# Altium schematic sheet 底板.SchDoc
size A3
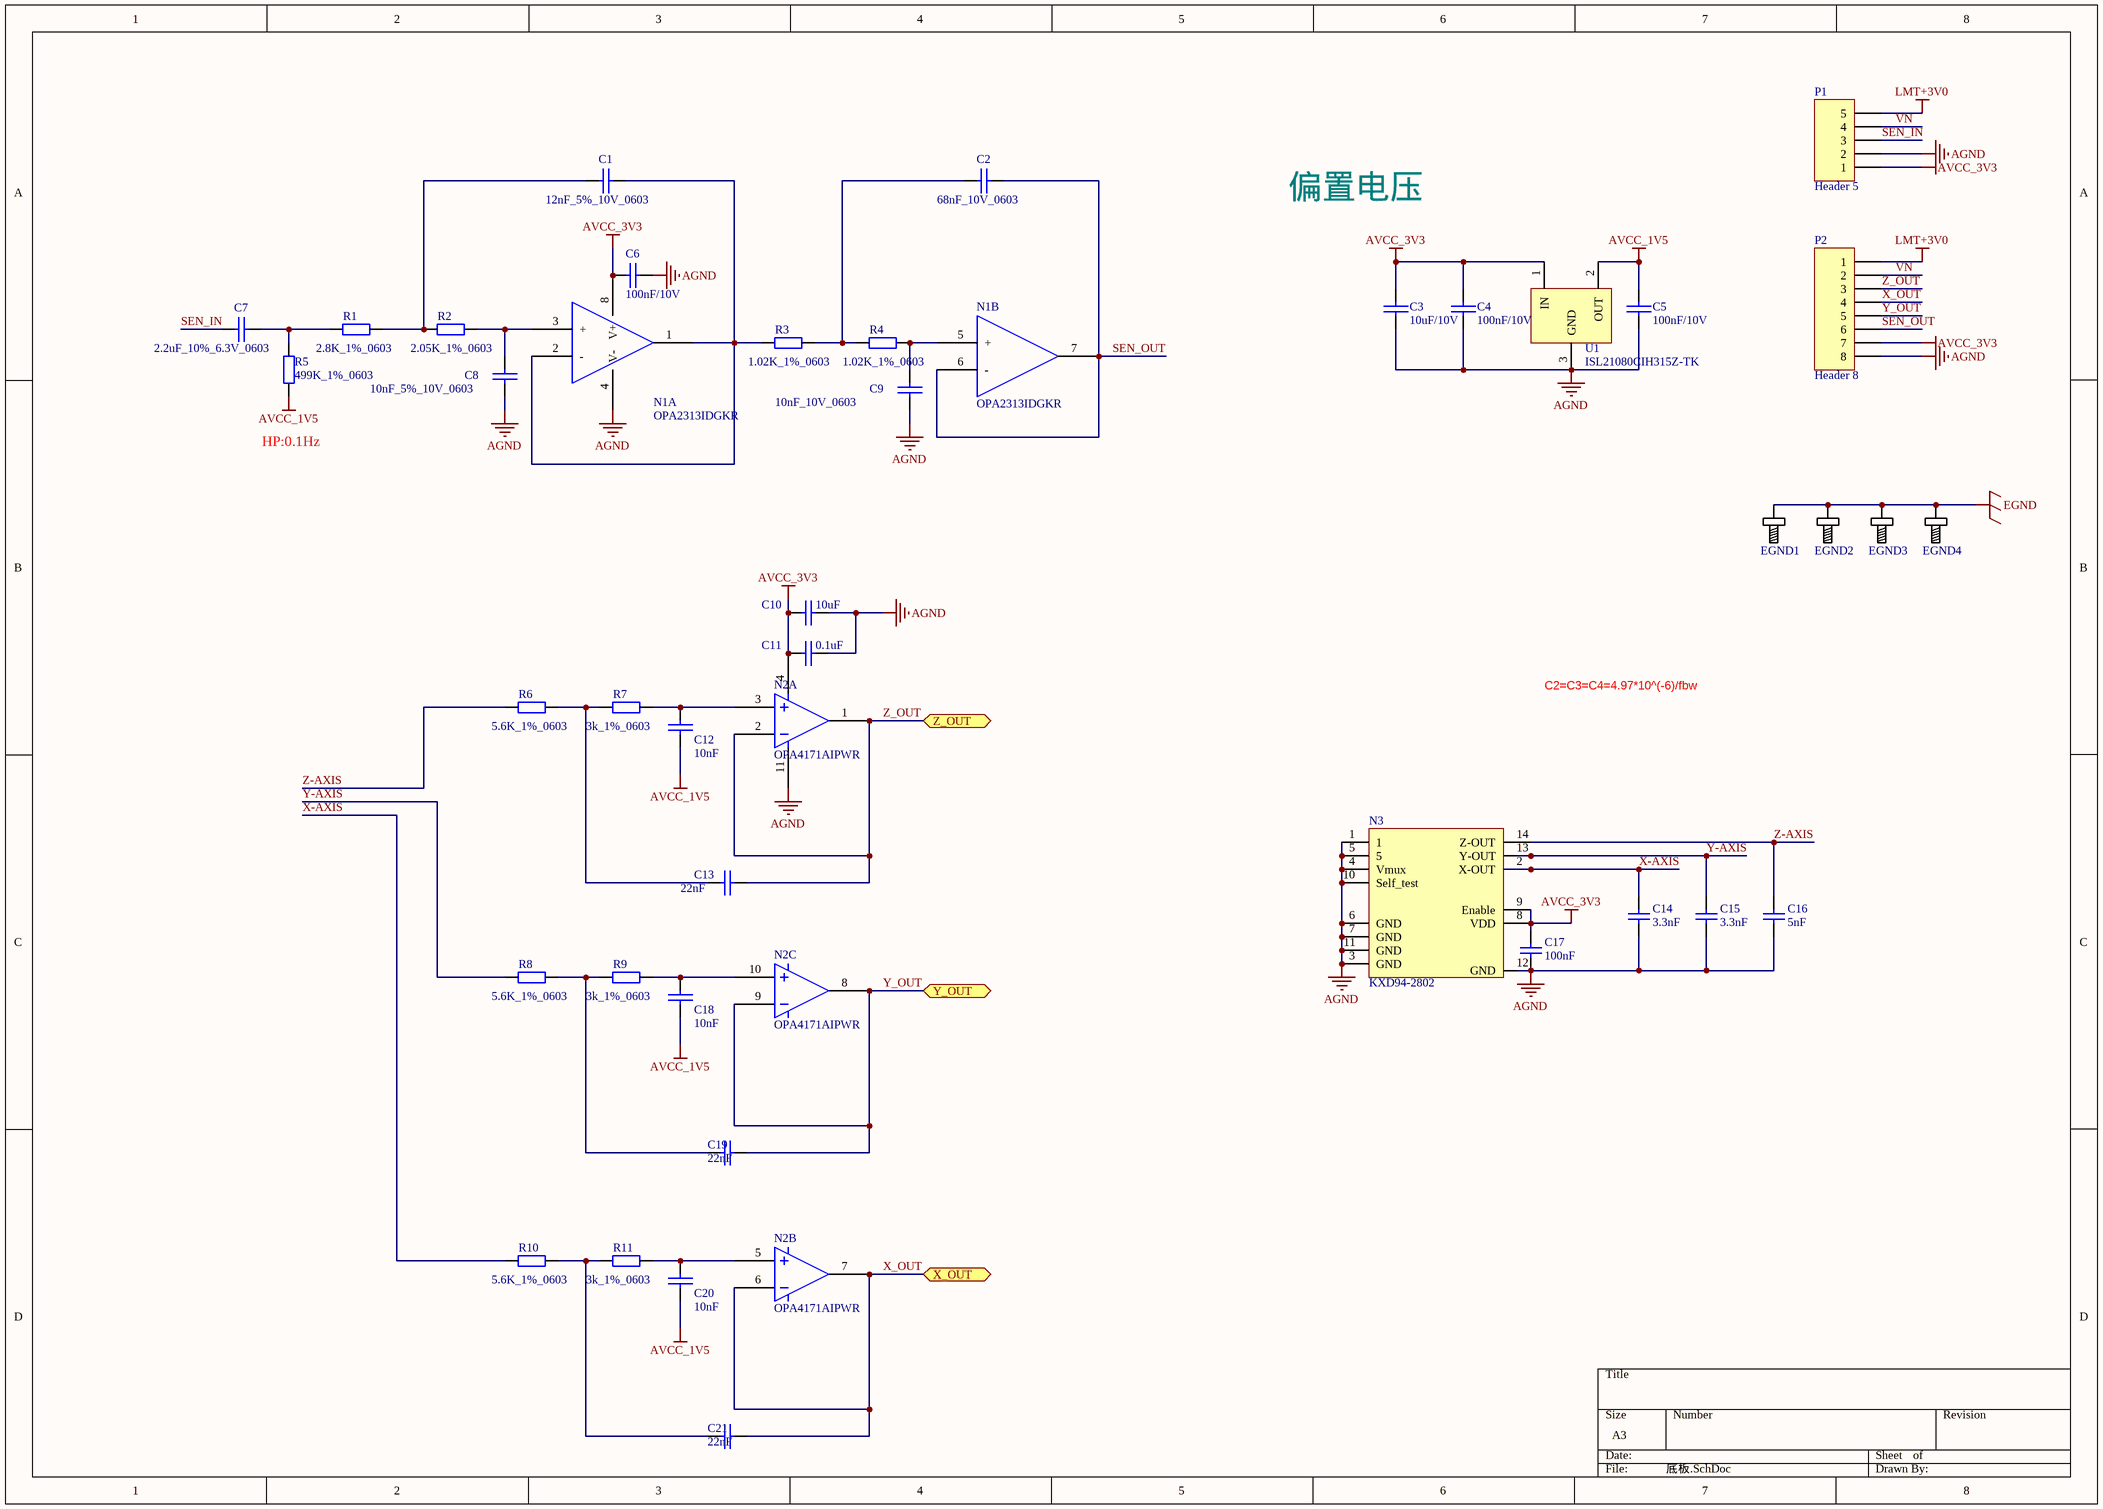
[diagram p0: 底板.SchDoc]

## Parts
C1  12nF_5%_10V_0603  [0603C]
C2  68nF_10V_0603  [0603C]
C3  10uF/10V  [0603c]
C4  100nF/10V  [0603C]
C5  100nF/10V  [0603C]
C6  100nF/10V  [0603C]
C7  2.2uF_10%_6.3V_0603  [0603c]
C8  10nF_5%_10V_0603  [0603C]
C9  10nF_10V_0603  [0603C]
C10  10uF  [0603C]
C11  0.1uF  [0603C]
C12  10nF  [0603C]
C13  22nF  [0603C]
C14  3.3nF  [0603C]
C15  3.3nF  [0603C]
C16  5nF  [0603C]
C17  100nF  [0603C]
C18  10nF  [0603C]
C19  22nF  [0603C]
C20  10nF  [0603C]
C21  22nF  [0603C]
EGND1  EGND  [M2.5x4_L]  (value not drawn)  (no BOM)
EGND2  EGND  [M2.5x4_L]  (value not drawn)  (no BOM)
EGND3  EGND  [M2.5x4_L]  (value not drawn)  (no BOM)
EGND4  EGND  [M2.5x4_L]  (value not drawn)  (no BOM)
N1  OPA2313IDGKR  [MSOP8_M]  (parts A,B of 2)
N2  OPA4171AIPWR  [TSSOP14_L]  (parts A,B,C of 4)
N3  KXD94-2802  [LFDFN-14]
P1  Header 5  [5p]
P2  Header 8  [FPC1.0-2H-WS-8P]
R1  2.8K_1%_0603  [0603R]
R2  2.05K_1%_0603  [0603R]
R3  1.02K_1%_0603  [0603R]
R4  1.02K_1%_0603  [0603R]
R5  499K_1%_0603  [0603R]
R6  5.6K_1%_0603  [0603R]
R7  3k_1%_0603  [0603R]
R8  5.6K_1%_0603  [0603R]
R9  3k_1%_0603  [0603R]
R10  5.6K_1%_0603  [0603R]
R11  3k_1%_0603  [0603R]
U1  ISL21080CIH315Z-TK  [SOT23-3N]

## Ports
X_OUT, Y_OUT, Z_OUT

## Nets
AGND: C3.2 C4.2 C5.2 C6.2 C8.1 C9.1 C10.1 C11.1 C14.2 C15.2 C16.2 C17.2 N1.4(V-) N2.11 N3.1 N3.3(GND) N3.4(Vmux) N3.5 N3.6(GND) N3.7(GND) N3.10(Self_test) N3.11(GND) N3.12(GND) P1.2 P2.8 U1.3(GND)
AVCC_1V5: C5.1 C12.2 C18.2 C20.2 R5.1 U1.2(OUT)
AVCC_3V3: C3.1 C4.1 C6.1 C10.2 C11.2 C17.1 N1.8(V+) N2.4 N3.8(VDD) N3.9(Enable) P1.1 P2.7 U1.1(IN)
EGND: EGND1.0 EGND2.0 EGND3.0 EGND4.0
LMT+3V0: P1.5 P2.1
SEN_IN: C7.2 P1.3
SEN_OUT: C2.1 N1.6(-) N1.7 P2.6
VN: P1.4 P2.2
X-AXIS: C14.1 N3.2(X-OUT) R10.1
X_OUT: C21.2 N2.6 N2.7 P2.4 ; port X_OUT
Y-AXIS: C15.1 N3.13(Y-OUT) R8.1
Y_OUT: C19.2 N2.8 N2.9 P2.5 ; port Y_OUT
Z-AXIS: C16.1 N3.14(Z-OUT) R6.1
Z_OUT: C13.2 N2.1 N2.2 P2.3 ; port Z_OUT
NetC1_1: C1.1 N1.1 N1.2(-) R3.1
NetC1_2: C1.2 R1.2 R2.1
NetC2_2: C2.2 R3.2 R4.1
NetC7_1: C7.1 R1.1 R5.2
NetC8_2: C8.2 N1.3(+) R2.2
NetC9_2: C9.2 N1.5(+) R4.2
NetC12_1: C12.1 N2.3 R7.2
NetC13_1: C13.1 R6.2 R7.1
NetC18_1: C18.1 N2.10 R9.2
NetC19_1: C19.1 R8.2 R9.1
NetC20_1: C20.1 N2.5 R11.2
NetC21_1: C21.1 R10.2 R11.1

## Notes on the sheet
- 偏置电压
- (near R5) HP:0.1Hz
- C2=C3=C4=4.97*10^(-6)/fbw

## Library data of the parts
C1 C2 C7-C9 = CAP
C3 = CAP: 10uF_X5R_10%_10V_0603
C4-C6 = CAP: 100nF_X5R_10%_10V_0603
C10 = CAP: 10uF_5%_10V_0603
C11 = CAP: 0.1uF_5%_10V_0603
C12 C18 C20 = CAP: 10nF_X5R_10%_10V_0603
C13 C19 C21 = CAP: 22nF_X5R_10%_10V_0603
C14 C15 = Cap: 3.3nF_X5R_10%_10V_0603; Value: 100pF; Published: 8-Jun-2000; LatestRevisionDate: 17-Jul-2002; LatestRevisionNote: Re-released for DXP Platform.; PackageReference: RAD-0.3; Publisher: Altium Limited; PackageDescription: Radial Cap, Thru-Hole; 2 Leads; 0.3 in Pin Spacing
C16 = Cap: 5nF_X5R_10%_10V_0603; Value: 100pF; Published: 8-Jun-2000; LatestRevisionDate: 17-Jul-2002; LatestRevisionNote: Re-released for DXP Platform.; PackageReference: RAD-0.3; Publisher: Altium Limited; PackageDescription: Radial Cap, Thru-Hole; 2 Leads; 0.3 in Pin Spacing
C17 = Cap: Capacitor; Value: 100pF; Published: 8-Jun-2000; LatestRevisionDate: 17-Jul-2002; LatestRevisionNote: Re-released for DXP Platform.; PackageReference: RAD-0.3; Publisher: Altium Limited; PackageDescription: Radial Cap, Thru-Hole; 2 Leads; 0.3 in Pin Spacing
EGND1-EGND4 = Screw_M3: M3铜柱，长：4mm
N1 = OP262: 精密运放
N2 = LM324: 贴片集成电路
N3 = KXR94
P1 = Header 5: Header, 5-Pin; LatestRevisionDate: 17-Jul-2002; LatestRevisionNote: Re-released for DXP Platform.; Publisher: Altium Limited
P2 = Header 8: Header, 8-Pin; LatestRevisionDate: 17-Jul-2002; LatestRevisionNote: Re-released for DXP Platform.; Publisher: Altium Limited
R1 R7 R9 R11 = Res2: Value: 6.81K; Published: 8-Jun-2000; LatestRevisionDate: 17-Jul-2002; LatestRevisionNote: Re-released for DXP Platform.; PackageReference: AXIAL-0.4; Publisher: Altium Limited
R2 = Res2: Value: 4.99K; Published: 8-Jun-2000; LatestRevisionDate: 17-Jul-2002; LatestRevisionNote: Re-released for DXP Platform.; PackageReference: AXIAL-0.4; Publisher: Altium Limited
R3 R4 = Res2: Value: 2.43K; Published: 8-Jun-2000; LatestRevisionDate: 17-Jul-2002; LatestRevisionNote: Re-released for DXP Platform.; PackageReference: AXIAL-0.4; Publisher: Altium Limited
R5 = Res: Value: 1K; Published: 8-Jun-2000; LatestRevisionDate: 17-Jul-2002; LatestRevisionNote: Re-released for DXP Platform.; Publisher: Altium Limited
R6 R8 R10 = Res2: Value: 1.8K; Published: 8-Jun-2000; LatestRevisionDate: 17-Jul-2002; LatestRevisionNote: Re-released for DXP Platform.; PackageReference: AXIAL-0.4; Publisher: Altium Limited
U1 = R: 参考电压 1.5V; Modified Date: 2012/9/18